# EAGLE design arduinoschematic1 (EAGLE 7.6.0)
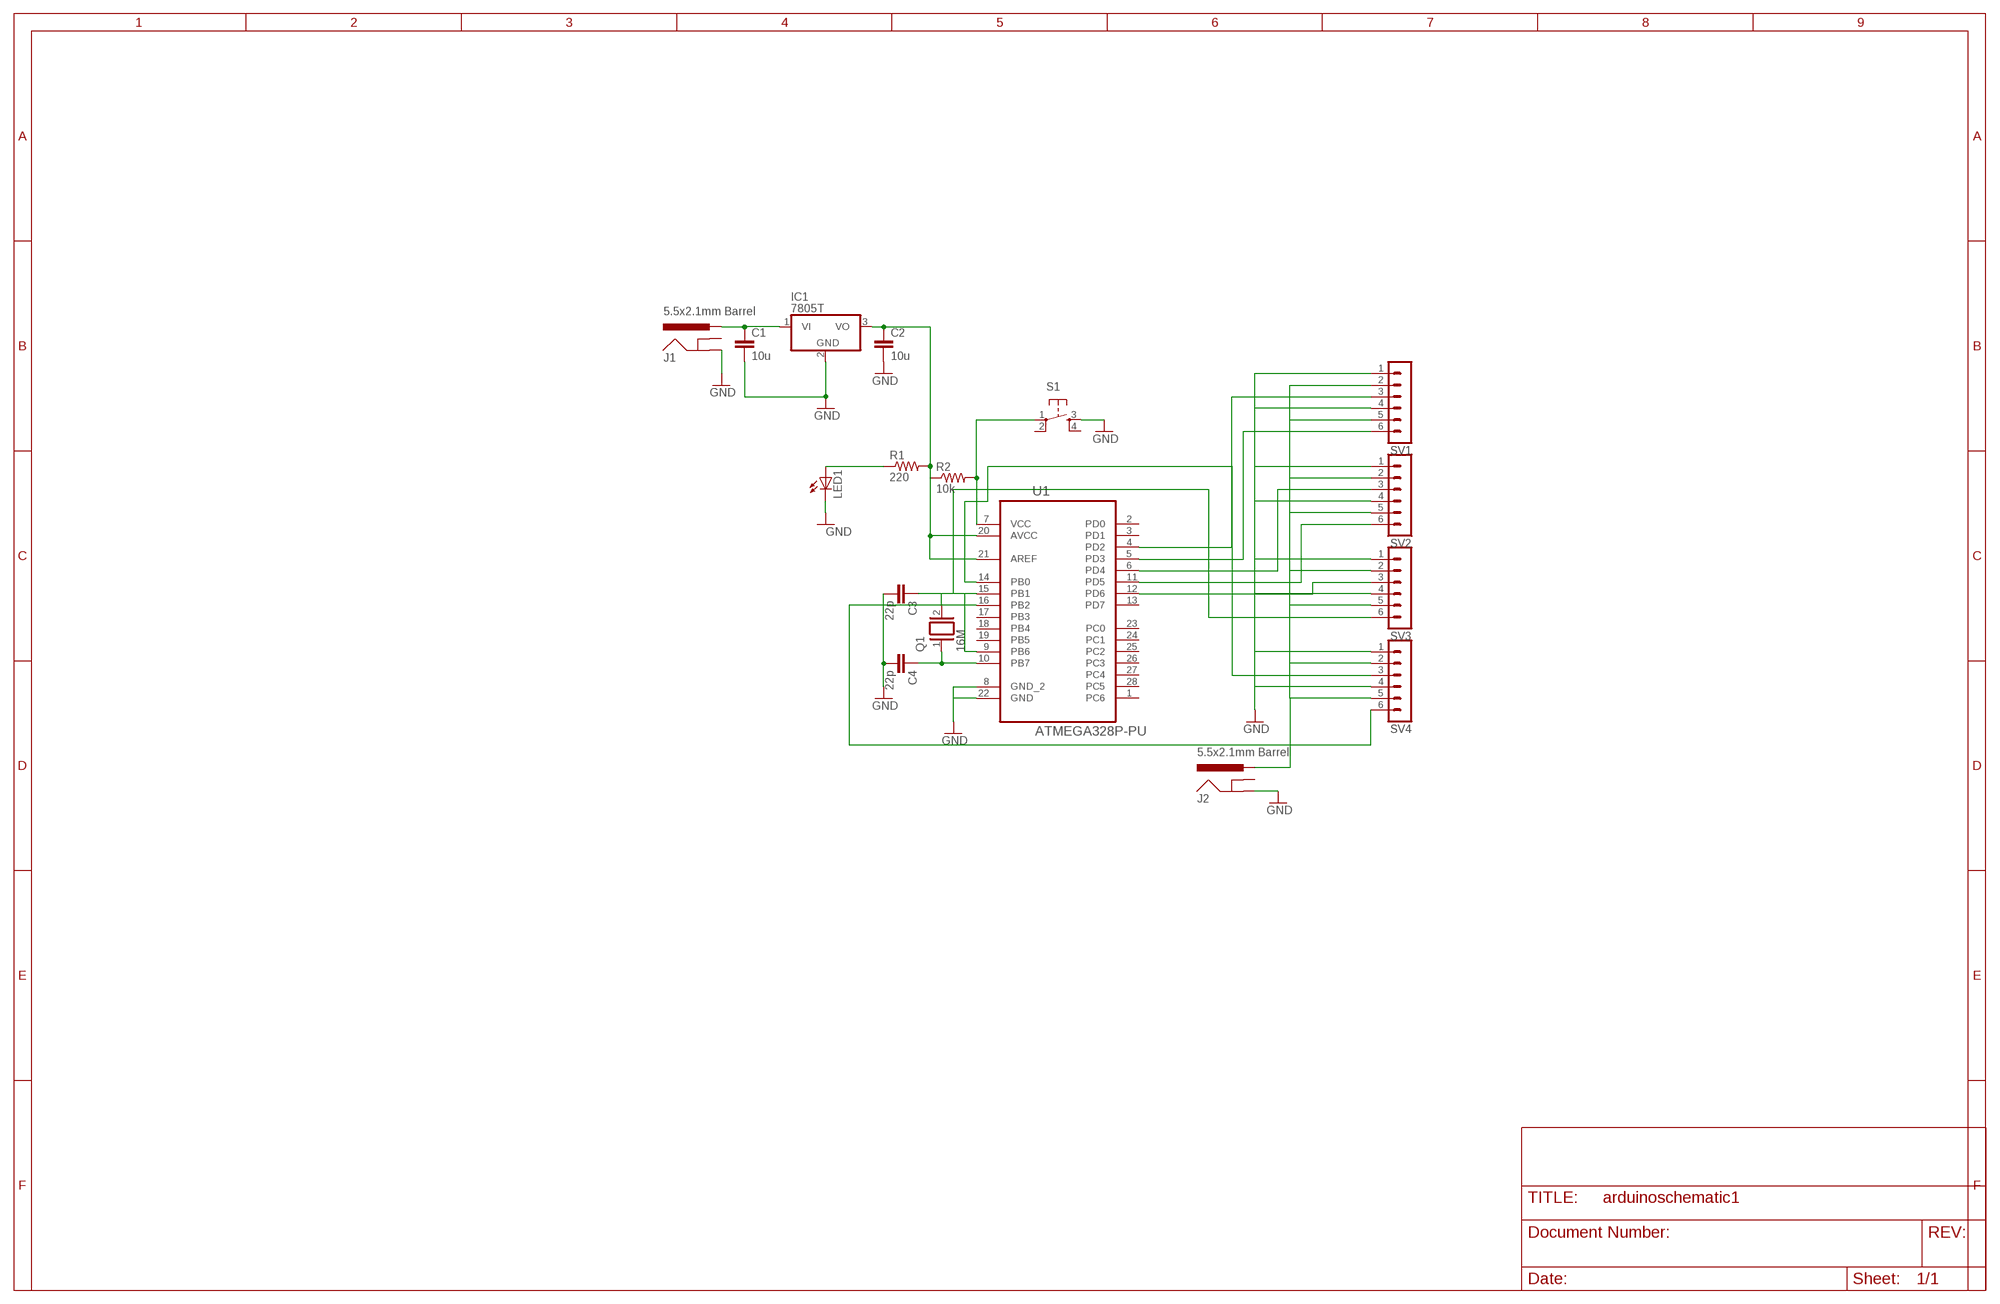
[diagram p0: schematic, sheet 1]

## Parts
C1  10u  C-EU050-030X075  [C050-030X075]
C2  10u  C-EU050-030X075  [C050-030X075]
C3  22p  C-EU025-030X050  [C025-030X050]
C4  22p  C-EU025-030X050  [C025-030X050]
IC1  7805T  [TO220H]
J1  5.5x2.1mm Barrel  POWER_JACKSMD  [POWER_JACK_SMD]
J2  5.5x2.1mm Barrel  POWER_JACKSMD  [POWER_JACK_SMD]
LED1  LEDSQR2X5  [LED2X5]
Q1  16M  XTAL/S  [QS]
R1  220  R-US_0204/5  [0204/5]
R2  10k  R-US_0204/5  [0204/5]
S1  TAC_SWITCHSMD  TAC_SWITCHPTH  [TACTILE-PTH]
SV1  MA06-1  [MA06-1]
SV2  MA06-1  [MA06-1]
SV3  MA06-1  [MA06-1]
SV4  MA06-1  [MA06-1]
U1  ATMEGA328P-PU  [DIP254P762X457-28]

## Nets
GND: C1.2 C2.2 C3.2 C4.2 IC1.2(GND) J1.P$4(GND) J2.P$4(GND) LED1.K(C) S1.3 SV1.1 SV1.4 SV2.1 SV2.4 SV3.1 SV3.4 SV4.1 SV4.4 U1.8(GND_2) U1.22(GND)
N$1: C2.1 IC1.3(VO) R1.2 R2.1 U1.20(AVCC) U1.21(AREF)
N$2: R2.2 S1.1 U1.7(VCC)
N$3: LED1.A R1.1
N$4: C4.1 Q1.1 U1.10(PB7)
N$5: SV1.3 U1.4(PD2)
N$6: C1.1 IC1.1(VI) J1.VIN0(PWR)
N$7: C3.1 Q1.2 U1.9(PB6)
N$8: SV1.6 U1.5(PD3)
N$9: SV2.3 U1.6(PD4)
N$10: SV2.6 U1.11(PD5)
N$11: SV3.3 U1.12(PD6)
N$12: SV3.6 U1.14(PB0)
N$13: SV4.3 U1.15(PB1)
N$14: SV4.6 U1.16(PB2)
N$15: J2.VIN0(PWR) SV1.2 SV1.5 SV2.2 SV2.5 SV3.2 SV3.5 SV4.2 SV4.5
Unconnected: J1.GND(GNDBREAK) J2.GND(GNDBREAK) S1.2 S1.4 U1.1(PC6) U1.2(PD0) U1.3(PD1) U1.13(PD7) U1.17(PB3) U1.18(PB4) U1.19(PB5) U1.23(PC0) U1.24(PC1) U1.25(PC2) U1.26(PC3) U1.27(PC4) U1.28(PC5)

## Library data of the parts
C1-C4 = resistor:C-EU: CAPACITOR, European symbol
IC1 = linear:78*: Positive VOLTAGE REGULATOR Source: http://cache.national.com/ds/LM/LM78L05.pdf http://www.fairchildsemi.com/ds/LM/LM7805.pdf
J1 J2 = SparkFun-Connectors:POWER_JACK: Power Jack This is the standard 5.5mm barrel jack for power. The PTH is the most common, proven, reliable, footprint. The Slot footprint only works if the mill layer is transmitted to the PCB fab house so be warned. Mating wall wart : TOL-00298 (and others); PROD_ID: CONN-08106; SF_ID: PRT-12748
LED1 = led:LED: LED OSRAM: - CHIPLED LG R971, LG N971, LY N971, LG Q971, LY Q971, LO R971, LY R971 LH N974, LH R974 LS Q976, LO Q976, LY Q976 LO Q996 - Hyper CHIPLED LW Q18S LB Q993, LB Q99A, LB R99A - SideLED LS A670, LO A670, LY A670, LG A670, LP A670 LB A673, LV A673, LT A673, LW A673 LH A674 LY A675 LS A676, LA A676, LO A676, LY A676, LW A676 LS A679, LY A679, LG A679 - Hyper Micro SIDELED® LS Y876, LA Y876, LO Y876, LY Y876 LT Y87S - SmartLED LW L88C, LW L88S LB L89C, LB L89S, LG L890 LS L89K, LO L89K, LY L89K LS L896, LA L896, LO L896, LY L896 - TOPLED LS T670, LO T670, LY T670, LG T670, LP T670 LSG T670, LSP T670, LSY T670, LOP T670, LYG T670 LG T671, LOG T671, LSG T671 LB T673, LV T673, LT T673, LW T673 LH T674 LS T676, LA T676, LO T676, LY T676, LB T676, LH T676, LSB T676, LW T676 LB T67C, LV T67C, LT T67C, LS T67K, LO T67K, LY T67K, LW E67C LS E67B, LA E67B, LO E67B, LY E67B, LB E67C, LV E67C, LT E67C LW T67C LS T679, LY T679, LG T679 LS T770, LO T770, LY T770, LG T770, LP T770 LB T773, LV T773, LT T773, LW T773 LH T774 LS E675, LA E675, LY E675, LS T675 LS T776, LA T776, LO T776, LY T776, LB T776 LHGB T686 LT T68C, LB T68C - Hyper Mini TOPLED® LB M676 - Mini TOPLED Santana® LG M470 LS M47K, LO M47K, LY M47K Source: http://www.osram.convergy.de LUXEON: - LUMILED® LXK2-PW12-R00, LXK2-PW12-S00, LXK2-PW14-U00, LXK2-PW14-V00 LXK2-PM12-R00, LXK2-PM12-S00, LXK2-PM14-U00 LXK2-PE12-Q00, LXK2-PE12-R00, LXK2-PE12-S00, LXK2-PE14-T00, LXK2-PE14-U00 LXK2-PB12-K00, LXK2-PB12-L00, LXK2-PB12-M00, LXK2-PB14-N00, LXK2-PB14-P00, LXK2-PB14-Q00 LXK2-PR12-L00, LXK2-PR12-M00, LXK2-PR14-Q00, LXK2-PR14-R00 LXK2-PD12-Q00, LXK2-PD12-R00, LXK2-PD12-S00 LXK2-PH12-R00, LXK2-PH12-S00 LXK2-PL12-P00, LXK2-PL12-Q00, LXK2-PL12-R00 Source: www.luxeon.com KINGBRIGHT: KA-3528ASYC Source: www.kingbright.com
Q1 = special:XTAL/S: CRYSTAL
R1 R2 = resistor:R-US_: RESISTOR, American symbol
S1 = SparkFun-Retired:TAC_SWITCH: Momentary Switch Button commonly used for reset or general input. Spark Fun Electronics SKU : COM-00097 SMT- SWCH-08247
SV1-SV4 = con-lstb:MA06-1: PIN HEADER; OC_FARNELL: unknown; OC_NEWARK: unknown
U1 = Atmel_By_element14_Batch_1-00:ATMEGA328P-PU: 8-bit Microcontroller with In-System Programmable Flash; MPN: ATMEGA328P-PU; OC_FARNELL: 1715487; OC_NEWARK: 15R0268; PACKAGE: PDIP-28; SUPPLIER: Atmel

## Board
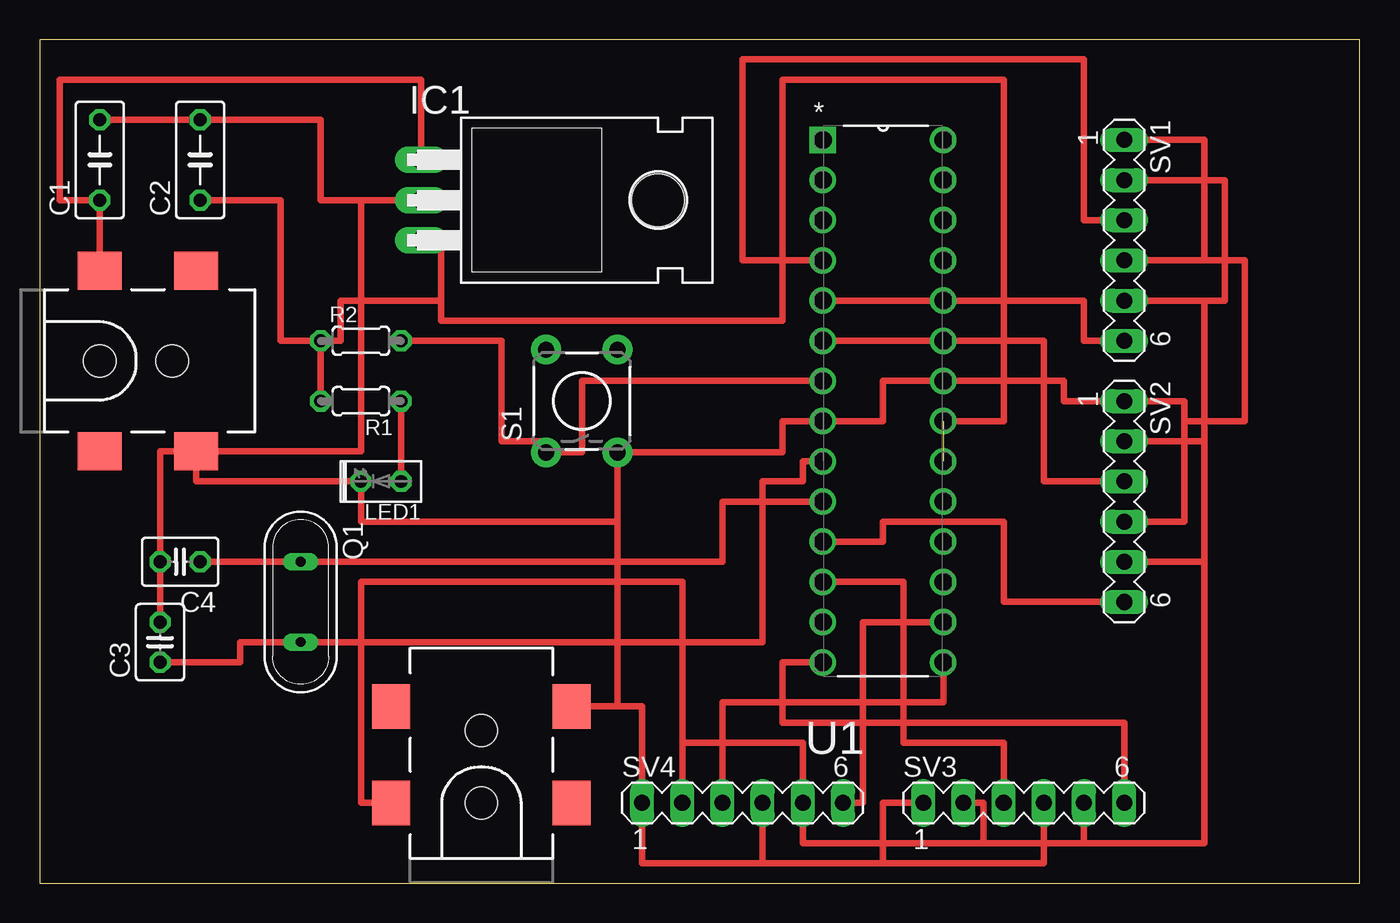
[diagram p1: board, top side]

Size 83.49 x 53.33 mm. Coordinates in mm from the lower left corner, seen from the top.
Outline: 0,0 83.49,0 83.49,53.33 0,53.33 0,0
Copper layers (1*16): Top 0.035mm / dielectric 1.5mm / Bottom 0.035mm
Design rules "default": minimum track width 10mil, minimum drill 24mil, track to track 8mil, track to pad 8mil, pad to pad 8mil, via to via 8mil, smd to smd 8mil, copper to edge 40mil, drill to drill 8mil, minimum pad ring 10mil, minimum via ring 8mil, stop-mask expansion 4mil, vias tented up to drill 0mil, thermal gap 10mil

### Footprints (pad centres in the part's own frame; a part is rotated, then mirrored left to right if it is on the bottom)
C050-030X075 = drill 0.813 octagon: 1 -2.54,0; 2 2.54,0
C025-030X050 = drill 0.813 octagon: 1 -1.27,0; 2 1.27,0
TO220H = drill 1.118 long: 1 -2.54,-10.16; 2 0,-10.16; 3 2.54,-10.16 | hole 3.302: 0,4.826
POWER_JACK_SMD = smd 2.8 x 2.4: GND 0,-5.7; P$4 6.1,-5.7; VIN0 0,5.7; VIN1 6.1,5.7 | hole 2.032: 0,0; 4.572,0
LED2X5 = drill 0.813 octagon: A -1.27,0; K 1.27,0
QS = drill 0.61 long: 1 -2.54,0; 2 2.54,0
0204/5 = drill 0.813 octagon: 1 -2.54,0; 2 2.54,0
TACTILE-PTH = drill 1.016 pad 1.88: 1 -3.251,2.261; 2 3.251,2.261; 3 -3.251,-2.261; 4 3.251,-2.261
MA06-1 = drill 1.016 long: 1 -6.35,0; 2 -3.81,0; 3 -1.27,0; 4 1.27,0; 5 3.81,0; 6 6.35,0
DIP254P762X457-28 = drill 1.118 square: 1 -7.62,33.02 | drill 1.118: 2 -7.62,30.48; 3 -7.62,27.94; 4 -7.62,25.4; 5 -7.62,22.86; 6 -7.62,20.32; 7 -7.62,17.78; 8 -7.62,15.24; 9 -7.62,12.7; 10 -7.62,10.16; 11 -7.62,7.62; 12 -7.62,5.08; 13 -7.62,2.54; 14 -7.62,0; 15 0,0; 16 0,2.54; 17 0,5.08; 18 0,7.62; 19 0,10.16; 20 0,12.7; 21 0,15.24; 22 0,17.78; 23 0,20.32; 24 0,22.86; 25 0,25.4; 26 0,27.94; 27 0,30.48; 28 0,33.02

### Placement (x,y rotation side)
C1  3.81,45.72 90 top
C2  10.16,45.72 90 top
C3  7.62,15.24 90 top
C4  8.89,20.32 180 top
IC1  34.29,43.18 270 top
J1  3.81,33.02 0 top
J2  27.94,5.08 90 top
LED1  21.59,25.4 180 top
Q1  16.51,17.78 270 top
R1  20.32,30.48 180 top
R2  20.32,34.29 0 top
S1  34.29,30.48 90 top
SV1  68.58,40.64 270 top
SV2  68.58,24.13 270 top
SV3  62.23,5.08 0 top
SV4  44.45,5.08 0 top
U1  57.15,13.97 0 top

### Tracks (layer width: path | path; a pad name or v marks a point on that pad's centre or on a via)
GND
  Top 0.406: C1.2 C2.2 17.78,48.26 17.78,43.18 20.32,43.18 | 36.55,22.86 20.32,22.86 LED1.K 9.91,25.4 J1.P$4 | IC1.2 20.32,43.18 | 36.55,22.86 S1.3 46.99,27.23 46.99,29.21 U1.8 53.34,29.21 53.34,31.75 U1.22 64.77,31.75 64.77,30.48 SV2.1 72.39,30.48 72.39,29.21 | J2.P$4 36.55,11.18 | 36.55,11.18 36.55,22.86 | 36.55,11.18 38.1,11.18 SV4.1 38.1,1.27 45.72,1.27 | J1.P$4 7.62,27.32 C4.2 C3.2 | 72.39,29.21 72.39,22.86 SV2.4 | 53.34,1.27 45.72,1.27 | SV4.4 45.72,1.27 | SV3.1 53.34,5.08 53.34,1.27 | 53.34,1.27 63.5,1.27 SV3.4 | SV1.1 73.66,46.99 73.66,39.37 SV1.4 76.2,39.37 76.2,29.21 72.39,29.21 | J1.P$4 20.32,27.32 20.32,43.18
N$1  (1 unrouted)
  Top 0.406: C2.1 15.24,43.18 15.24,34.29 R2.1 | R2.1 R1.2 | IC1.3 25.4,40.64 25.4,36.83 | 25.4,36.83 25.4,35.56 46.99,35.56 46.99,50.8 60.96,50.8 60.96,29.21 U1.21 | R2.1 19.05,34.29 19.05,36.83 25.4,36.83
N$2
  Top 0.406: R2.2 29.21,34.29 29.21,27.94 32.03,27.94 S1.1 34.29,27.23 34.29,31.75 U1.7
N$3
  Top 0.406: R1.1 LED1.A
N$4
  Top 0.406: C4.1 Q1.1 43.18,20.32 43.18,24.13 U1.10
N$5
  Top 0.406: U1.4 44.45,39.37 44.45,52.07 66.04,52.07 66.04,41.91 SV1.3
N$6
  Top 0.406: J1.VIN0 C1.1 1.27,43.18 1.27,50.8 24.13,50.8 IC1.1
N$7
  Top 0.406: C3.1 12.7,13.97 12.7,15.24 Q1.2 45.72,15.24 45.72,25.4 48.26,25.4 48.26,26.67 U1.9
N$8
  Top 0.406: U1.5 66.04,36.83 66.04,34.29 SV1.6
N$9
  Top 0.406: U1.6 63.5,34.29 63.5,25.4 SV2.3
N$10
  Top 0.406: SV2.6 60.96,17.78 60.96,22.86 53.34,22.86 53.34,21.59 U1.11
N$11
  Top 0.406: SV3.3 60.96,8.89 54.61,8.89 54.61,19.05 U1.12
N$12
  Top 0.406: SV3.6 68.58,10.16 46.99,10.16 46.99,13.97 U1.14
N$13
  Top 0.406: SV4.3 43.18,11.43 57.15,11.43 U1.15
N$14
  Top 0.406: SV4.6 52.07,5.08 52.07,16.51 U1.16
N$15
  Top 0.406: 73.66,27.94 73.66,20.32 | 73.66,20.32 SV2.5 | J2.VIN0 20.32,5.08 20.32,19.05 40.64,19.05 40.64,8.89 | SV4.2 40.64,8.89 | 40.64,8.89 48.26,8.89 SV4.5 48.26,2.54 59.69,2.54 | SV3.2 59.69,5.08 59.69,2.54 | 59.69,2.54 66.04,2.54 | SV3.5 66.04,2.54 | 66.04,2.54 73.66,2.54 73.66,20.32 | SV2.2 73.66,27.94 | 73.66,27.94 73.66,36.83 SV1.5 74.93,36.83 74.93,44.45 SV1.2